# Altium schematic sheet tps5430_VIN_5V.SchDoc
size A4
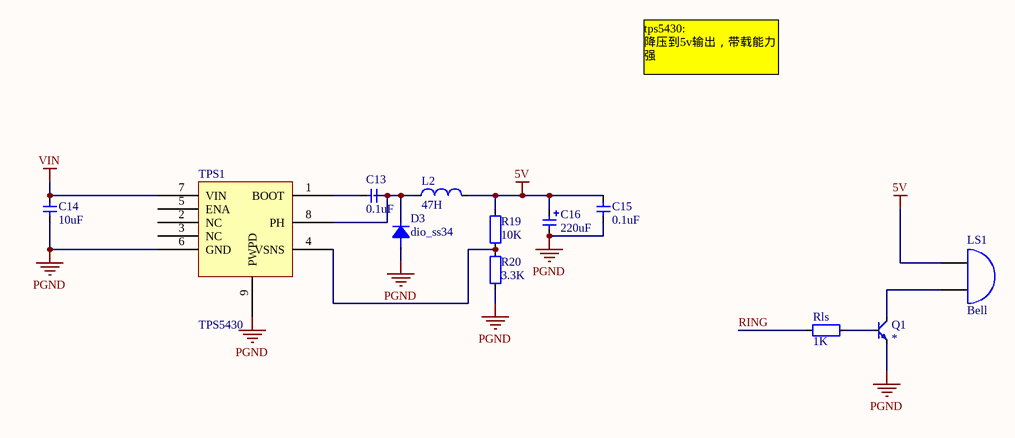
[diagram p0: tps5430_VIN_5V.SchDoc]

## Parts
C13  value 0.1uF  [CAP_0603]  (hidden comment: Cap_0603)
C14  value 10uF  [CAP_0603]  (hidden comment: Cap_0603)
C15  value 0.1uF  [CAP_0603]  (hidden comment: Cap_0603)
C16  value 220uF  [CAP-TAN-7343/CAPD]  (hidden comment: Cap_Tan_0805)
D3  dio_ss34  [dio_ss34]
L2  value 47H  [indmm5x1.2x4x5]  (hidden comment: Ind_0603)
LS1  Bell  [Bell-5.6-0.6-9mm]
Q1  BJT_NPN  [SOT23-3]  (value not drawn)
R19  value 10K  [RES_0603]  (hidden comment: Res_0603)
R20  value 3.3K  [RES_0603]  (hidden comment: Res_0603)
Rls  value 1K  [RES_0603]  (hidden comment: Res_0603)
TPS1  TPS5430  [SOP_E150_9]

## Nets
5V: C15.2 C16.1 L2.2 LS1.1(A) R19.2
PGND: C14.1 C15.1 C16.2 D3.1 Q1.2(E) R20.1 TPS1.6(GND) TPS1.9(PWPD)
VIN: C14.2 TPS1.7(VIN)
RING: Rls.1
NetC13_1: C13.1 TPS1.1(BOOT)
NetC13_2: C13.2 D3.2 L2.1 TPS1.8(PH)
NetLS1_2: LS1.2(B) Q1.3(C)
NetQ1_1: Q1.1(B) Rls.2
NetR19_1: R19.1 R20.2 TPS1.4(VSNS)

Not connected (* = marked no-connect by the designer): TPS1 2(NC) 3(NC) 5(ENA)

## Notes on the sheet
- tps5430:
  降压到5v输出，带载能力强

## Library data of the parts
C13-C15 = Cap_0603: Capacitor
C16 = Cap_Tan_0805: Capacitor
L2 = Ind_0603: Inductor
LS1 = Bell: Electrical Bell; Published: 24-Mar-1999; LatestRevisionDate: 17-Jul-2002; LatestRevisionNote: Re-released for DXP Platform.; PackageReference: PIN2; Publisher: Altium Limited
Q1 = BJT_NPN: Transistor; Value: *
R19 R20 Rls = Res_0603: Resistor